# EAGLE design Adafruit SPI FRAM (EAGLE 6.3)
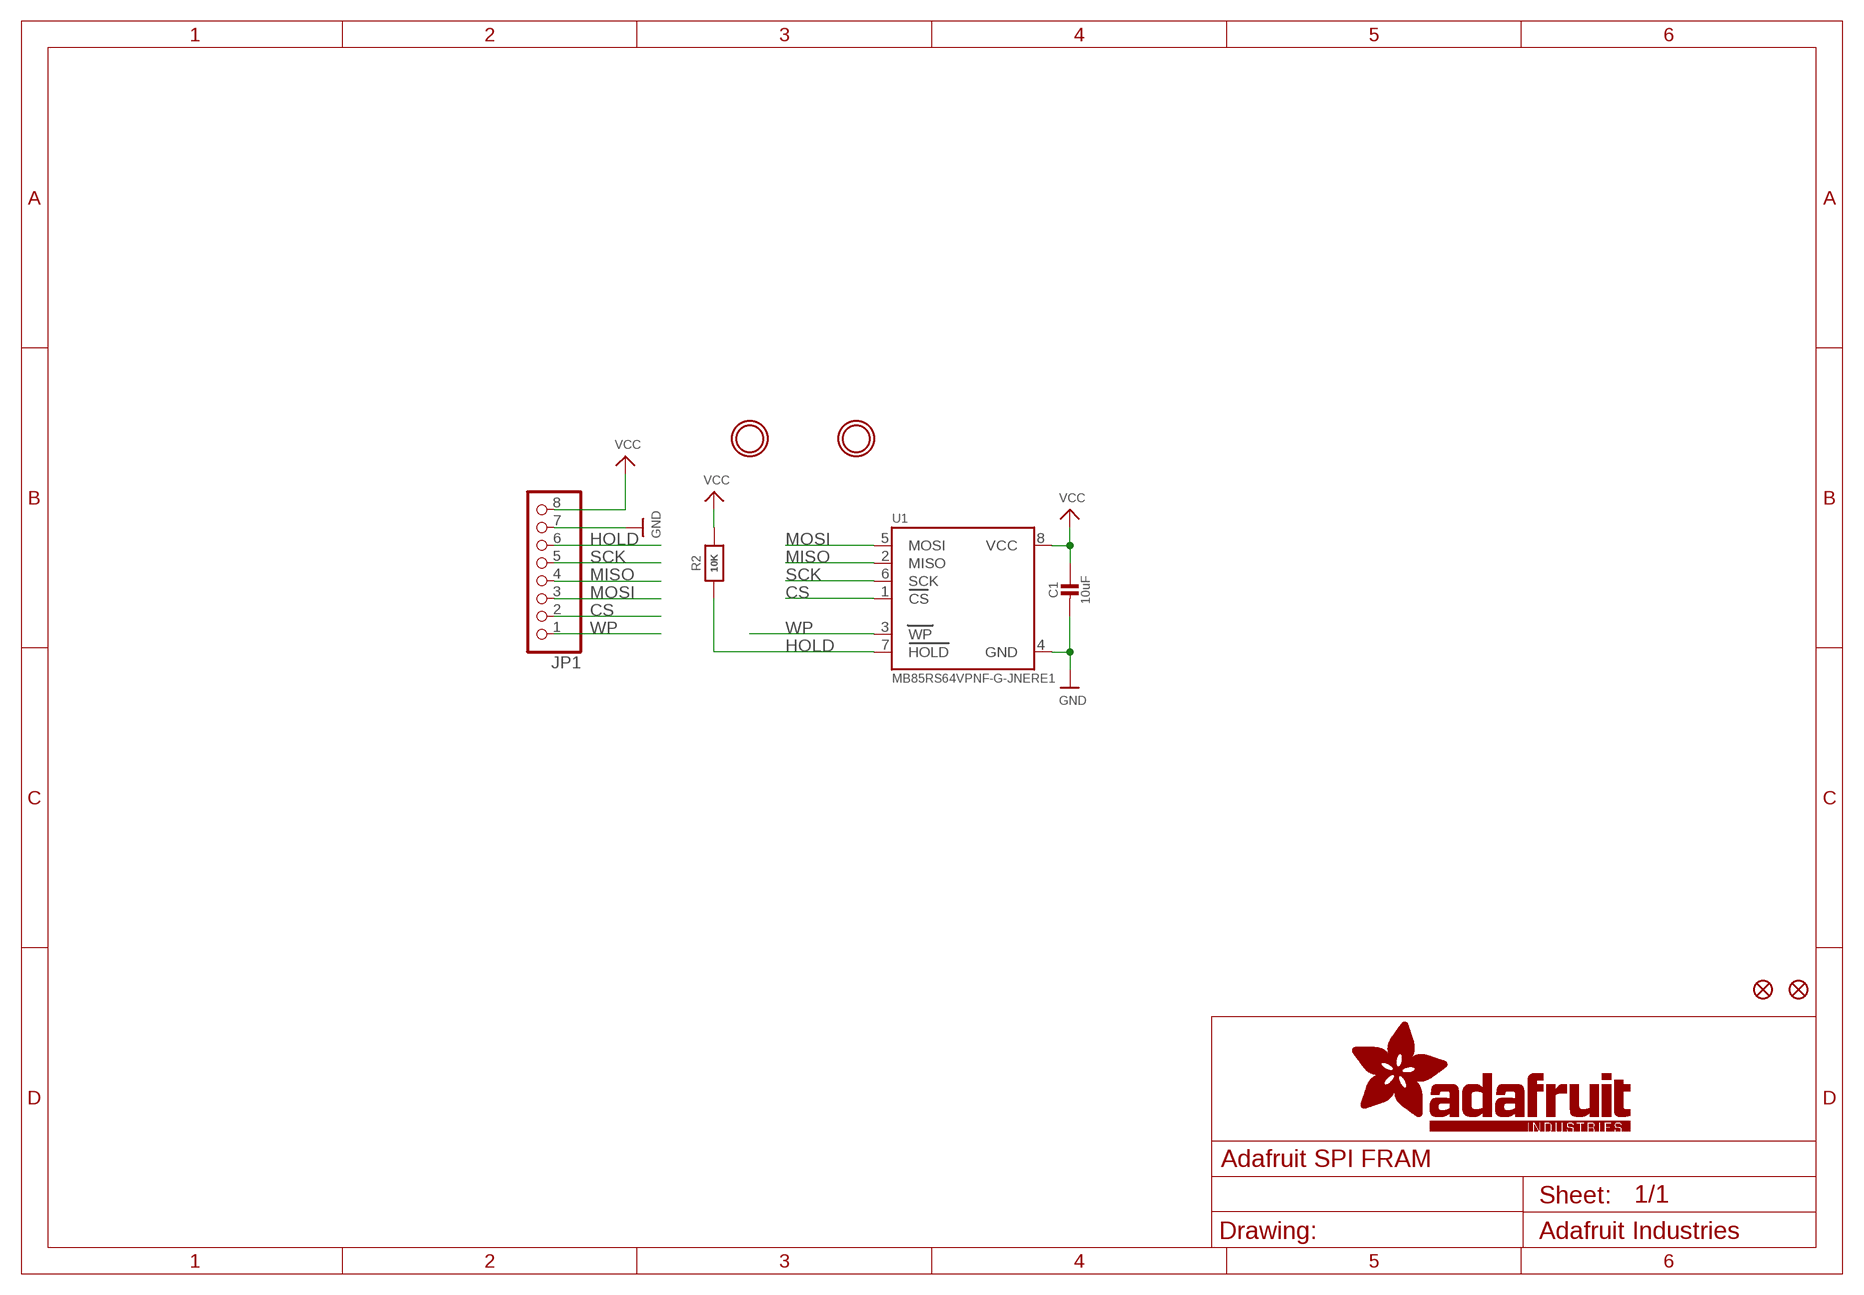
[diagram p0: schematic, sheet 1]

## Parts
C1  10uF  CAP_CERAMIC_0805MP  [_0805MP]
FID1  FIDUCIAL""  [FIDUCIAL_1MM]
FID2  FIDUCIAL""  [FIDUCIAL_1MM]
JP1  HEADER-1X870MIL  [1X08_ROUND_70]
R2  10K  RESISTOR_0805MP  [_0805MP]
U1  MB85RS64VPNF-G-JNERE1  FRAM_SOIC8_SPI  [SOIC8_150MIL]
U$5  MOUNTINGHOLE2.5  [MOUNTINGHOLE_2.5_PLATED]
U$6  MOUNTINGHOLE2.5  [MOUNTINGHOLE_2.5_PLATED]

## Nets
CS: JP1.2 U1.1(CS)
GND: C1.2 JP1.7 U1.4(GND)
HOLD: JP1.6 R2.1 U1.7(HOLD)
MISO: JP1.4 U1.2(MISO)
MOSI: JP1.3 U1.5(MOSI)
SCK: JP1.5 U1.6(SCK)
VCC: C1.1 JP1.8 R2.2 U1.8(VCC)
WP: JP1.1 U1.3(WP)

## Library data of the parts
C1 = microbuilder:CAP_CERAMIC: Ceramic Capacitors For new designs, use the packages preceded by an '_' character since they are more reliable: The following footprints should be used on most boards: _0402 - Standard footprint for regular board layouts _0603 - Standard footprint for regular board layouts _0805 - Standard footprint for regular board layouts _1206 - Standard footprint for regular board layouts For extremely tight-pitch boards where space is at a premium, the following 'micro-pitch' footprints can be used (smaller pads, no silkscreen outline, etc.): _0402MP - Micro-pitch footprint for very dense/compact boards _0603MP - Micro-pitch footprint for very dense/compact boards _0805MP - Micro-pitch footprint for very dense/compact boards _1206MP - Micro-pitch footprint for very dense/compact boards
FID1 FID2 = microbuilder:FIDUCIAL: Fiducial Alignment Points Various fiducial points for machine vision alignment.; BOM: EXCLUDE
JP1 = microbuilder:HEADER-1X8: PIN HEADER
R2 = microbuilder:RESISTOR: Resistors For new designs, use the packages preceded by an '_' character since they are more reliable: The following footprints should be used on most boards: _0402 - Standard footprint for regular board layouts _0603 - Standard footprint for regular board layouts _0805 - Standard footprint for regular board layouts _1206 - Standard footprint for regular board layouts For extremely tight-pitch boards where space is at a premium, the following 'micro-pitch' footprints can be used (smaller pads, no silkscreen outline, etc.): _0402MP - Micro-pitch footprint for very dense/compact boards _0603MP - Micro-pitch footprint for very dense/compact boards _0805MP - Micro-pitch footprint for very dense/compact boards _1206MP - Micro-pitch footprint for very dense/compact boards
U1 = microbuilder:FRAM_SOIC8_SPI: SPI FRAM - SOIC8 Package 64KBit (8Kx8) - MB85RS64VPNF-G-JNERE1 - SOIC-8 150 Mil, 3-5.5V, -40°C-85°C, 20MHz
U$5 U$6 = microbuilder:MOUNTINGHOLE: Mounting Hole For #2 screws (0.086"/2.18mm width, 0.094"/2.4mm hole) use 2.5mm; BOM: EXCLUDE

## Board
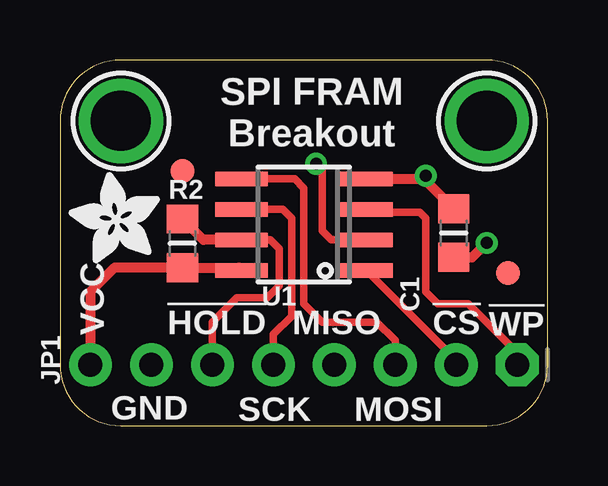
[diagram p1: board, top side]
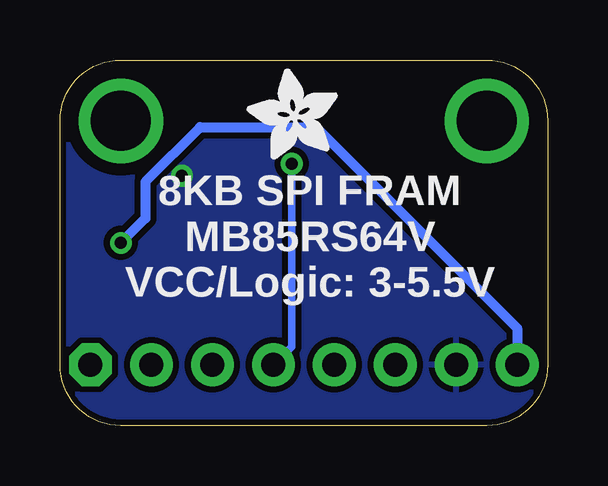
[diagram p2: board, bottom side, seen from below]

Size 20.32 x 15.24 mm. Coordinates in mm from the lower left corner, seen from the top.
Outline: 0,12.7 0,2.54 arc90 2.54,0 17.78,0 arc90 20.32,2.54 20.32,12.7 arc90 17.78,15.24 2.54,15.24 arc90 0,12.7
Copper layers (1*16): Top 0.035mm / dielectric 1.5mm / Bottom 0.035mm
Design rules "adafruit": minimum track width 8mil, minimum drill 15.5mil, track to track 8mil, track to pad 8mil, pad to pad 8mil, via to via 8mil, smd to smd 8mil, copper to edge 10mil, drill to drill 8mil, minimum pad ring 10mil, minimum via ring 8mil, stop-mask expansion 4mil, vias tented up to drill 20mil, thermal gap 10mil

### Footprints (pad centres in the part's own frame; a part is rotated, then mirrored left to right if it is on the bottom)
_0805MP = smd 1.2 x 1.3: 1 -1.016,0; 2 1.016,0
FIDUCIAL_1MM = smd 1 x 1: 1 0,0
1X08_ROUND_70 = drill 1 pad 1.778 octagon: 1 -8.89,0 | drill 1 pad 1.778: 2 -6.35,0; 3 -3.81,0; 4 -1.27,0; 5 1.27,0; 6 3.81,0; 7 6.35,0; 8 8.89,0
SOIC8_150MIL = smd 0.6 x 2.2: 1 -1.905,-2.6; 2 -0.635,-2.6; 3 0.635,-2.6; 4 1.905,-2.6; 5 1.905,2.6; 6 0.635,2.6; 7 -0.635,2.6; 8 -1.905,2.6
MOUNTINGHOLE_2.5_PLATED = drill 2.5 pad 3.2: P$1 0,0

### Placement (x,y rotation side)
C1  16.4,8.03 90 top
FID1  5.1,10.61 0 top
FID2  18.67,6.37 0 top
JP1  10.16,2.54 180 top
R2  5.1,7.6 270 top
U1  10.16,8.38 90 top
U$4  [ADAFRUIT_3.5MM]  4.17,6.76 90 top
U$5  17.78,12.7 0 top
U$6  2.54,12.7 0 top
U$7  [ADAFRUIT_3.5MM]  8.74,11.08 90 bottom

### Tracks (layer width: path | path; a pad name or v marks a point on that pad's centre or on a via)
CS
  Top 0.305: U1.1 16.51,2.73 JP1.2
GND  (via drill 0.5)
  Top 0.406: C1.2 15.16,10.29 U1.4 15.11,10.29 v15.24,10.41
  pour Bottom (isolate 0.254): 0,15.29 20.46,15.29 20.46,0 0,0
HOLD
  Top 0.305: U1.7 8.76,7.75 9.14,7.37 9.14,5.84 8.64,5.33 7.37,5.33 6.35,4.32 JP1.6
  Top 0.406: U1.7 5.97,7.75 R2.1
MISO  (via drill 0.5)
  Top 0.305: U1.2 11.3,7.75 10.92,8.13 10.92,10.67 v10.67,10.92
  Bottom 0.305: v10.67,10.92 10.67,3.3 JP1.4
MOSI
  Top 0.305: U1.5 9.78,10.29 10.16,9.91 10.16,5.08 10.92,4.32 13.21,4.32 13.97,3.56 JP1.3
SCK
  Top 0.305: U1.6 9.27,9.02 9.65,8.64 9.65,4.57 8.89,3.81 JP1.5
VCC  (via drill 0.5)
  Top 0.406: U1.8 7.45,6.58 R2.2 5.08,6.6 2.29,6.6 1.27,5.59 1.27,4.32 JP1.8 | C1.1 17.18,7.02 v17.78,7.62
  Bottom 0.406: v17.78,7.62 16.76,8.64 16.76,10.16 14.48,12.45 9.65,12.45 1.27,4.06 JP1.8
WP
  Top 0.305: JP1.1 19.05,3.05 17.02,5.08 15.75,5.08 15.24,5.59 15.24,8.64 14.99,8.89 12.89,8.89 U1.3

### Text on the board
tPlace: SPI FRAM / Breakout | VCC | !HOLD | MISO | !CS | !WP | GND | SCK | MOSI
bPlace: 8KB SPI FRAM / MB85RS64V / VCC/Logic: 3-5.5V